# Altium schematic sheet CS4398_DAC.SchDoc: CS4398 DAC
size A4; DocumentNumber: 7; SheetNumber: 7; SheetTotal: 8
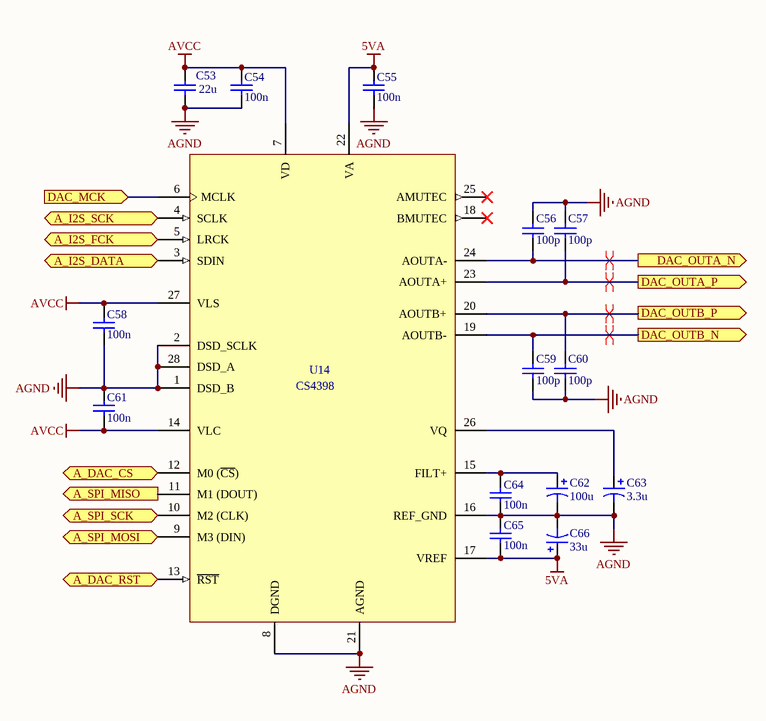
[diagram p0: CS4398_DAC.SchDoc]

## Parts
C53  22u  [PCB-rf0pzaa82dpbeu9l4sxm-1]
C54  100n  [PCB-rf0pzaa82dpbeu9l4sxm-1]
C55  100n  [PCB-rf0pzaa82dpbeu9l4sxm-1]
C56  100p  [C0402_B]
C57  100p  [C0402_B]
C58  100n  [PCB-rf0pzaa82dpbeu9l4sxm-1]
C59  100p  [C0402_B]
C60  100p  [C0402_B]
C61  100n  [PCB-rf0pzaa82dpbeu9l4sxm-1]
C62  100u  [PCB-9bfrndi9huxo1n7cihpl-1]
C63  3.3u  [PCB-3kuidc2n9u2t7zucpvy0-1]
C64  100n  [PCB-rf0pzaa82dpbeu9l4sxm-1]
C65  100n  [PCB-rf0pzaa82dpbeu9l4sxm-1]
C66  33u  [PCB-3kuidc2n9u2t7zucpvy0-1]
U14  CS4398  [PCB-b46ddvbc1rxbl1gahzd1-1]

## Ports
A_DAC_CS (in), A_DAC_RST (in), A_I2S_DATA (in), A_I2S_FCK (in), A_I2S_SCK (in), A_SPI_MISO (out), A_SPI_MOSI (in), A_SPI_SCK (in), DAC_MCK (in), DAC_OUTA_N (out), DAC_OUTA_P (out), DAC_OUTB_N (out), DAC_OUTB_P (out)

## Nets
5VA: C55.1 C65.2 C66.1 U14.17(VREF) U14.22(VA)
AGND: C53.1 C54.2 C55.2 C56.1 C57.1 C58.2 C59.2 C60.2 C61.1 C62.2 C63.2 C64.2 C65.1 C66.2 U14.1(DSD_B) U14.2(DSD_SCLK) U14.8(DGND) U14.16(REF_GND) U14.21(AGND) U14.28(DSD_A)
AVCC: C53.2 C54.1 C58.1 C61.2 U14.7(VD) U14.14(VLC) U14.27(VLS)
A_DAC_CS: U14.12(M0_(~{CS})) ; port A_DAC_CS
A_DAC_RST: U14.13(~{RST}) ; port A_DAC_RST
A_I2S_DATA: U14.3(SDIN) ; port A_I2S_DATA
A_I2S_FCK: U14.5(LRCK) ; port A_I2S_FCK
A_I2S_SCK: U14.4(SCLK) ; port A_I2S_SCK
A_SPI_MISO: U14.11(M1_(DOUT)) ; port A_SPI_MISO
A_SPI_MOSI: U14.9(M3_(DIN)) ; port A_SPI_MOSI
A_SPI_SCK: U14.10(M2_(CLK)) ; port A_SPI_SCK
DAC_MCK: U14.6(MCLK) ; port DAC_MCK
DAC_OUTA_N: C56.2 U14.24(AOUTA-) ; port DAC_OUTA_N
DAC_OUTA_P: C57.2 U14.23(AOUTA+) ; port DAC_OUTA_P
DAC_OUTB_N: C59.1 U14.19(AOUTB-) ; port DAC_OUTB_N
DAC_OUTB_P: C60.1 U14.20(AOUTB+) ; port DAC_OUTB_P
NetC62_1: C62.1 C64.1 U14.15(FILT+)
NetC63_1: C63.1 U14.26(VQ)

Not connected (* = marked no-connect by the designer): U14 18(BMUTEC)* 25(AMUTEC)*

## Layout directives
differential pair: DAC_OUTA_N, DAC_OUTA_P, DAC_OUTB_N, DAC_OUTB_P

## Notes on the sheet
- Title
- Size:
- Date:
- A4
- Number:
- Time:
- Revision:
- Sheet
- of
- File:

## Library data of the parts
C53-C55 C58 C61 C64 C65 = CMP-x8hddryxw4o380xfi98v-3: Generic Capacitor 0603; LCSC Part #: C19702
  C53: LCSC Part #: C59461; LCSC Part #: C25804; LCSC Part #: C21190; LCSC Part #: C81598
  C54 C55 C58 C61 C64 C65: CustomComponentID: x8hddryxw4o380xfi98v; LCSC Part #: C14663; LCSC Part #: C109474
C56 C57 C59 C60 = CMP-144183-3: 0402 1 uF 10 V ±10 % Tolerance X5R SMT Multilayer Ceramic Capacitor; Manufacturer Part Number: CC0402KRX5R6BB105; Lead-Free Status: Lead Free; Capacitance: 1e-06 F; Voltage Rating (DC): 10.0 V; Capacitance Tolerance: ±10%; Packaging: Cut Tape (CT); Octopart Url: http://octopart.com/cc0402krx5r6bb105-yageo-42244620; Case/Package: 0402; Mounting Style: Surface Mount; REACH SVHC Compliance: No SVHC; RoHS: Compliant; OctopartID: a1786af61e127ebf; Dielectric Characteristic: X5R; Seller Landing  Url: https://octopart-clicks.com/click/track?country=US&ak=8157f166&sig=010a0f3&sid=5489&ppid=42244620&vpid=115208218&ct=offers; Number of Pins: 2; LCSC Part #: C1546
C62 = CMP-6546a831a81eba81-4: In a Pack of 25, KEMET 100?F Electrolytic Capacitor 10V dc Through Hole - A758EK107M1AAAE016; Capacitance: 100 µF; Equivalent Series Resistance (ESR): 16.0 m?; Voltage Rating (DC): 10.0 V; Capacitance Tolerance: ±20%; Mounting Style: Through Hole; Size-Diameter: 6.30 mm; Size-Height: 8.00 mm; Operating Temperature: 105 °C (max); RoHS: Compliant; Manufacturer Part Number: A758EK107M1AAAE016; Octopart URL: https://octopart.com/a758ek107m1aaae016-kemet-75360318; OctopartID: 6546a831a81eba81
C63 C66 = CMP-e4c92dfab4043b0e-1: Cap Tant Solid 10uF 10V B CASE 10% (3.5 X 2.8 X 1.9mm) Inward L SMD 3528-21 2.5 Ohm 125C T/R; Manufacturer Part Number: TAJB106K010RNJ; Voltage Rating (DC): 10.0 V; Lead-Free Status: Lead Free; Equivalent Series Resistance (ESR): 2.50 Ω; Capacitance: 10.0 µF; Q-Factor: 6.0; Mounting Style: Surface Mount; Capacitance Tolerance: ±10%; Number of Pins: 2; RoHS: Compliant; Case/Package: 1210; Packaging: Cut Tape (CT), Tape & Reel (TR); OctopartID: e4c92dfab4043b0e; Octopart URL: http://octopart.com/tajb106k010rnj-avx-3765675; REACH SVHC Compliance: No SVHC
U14 = CMP-031cca108660dcdb-1: DAC 2-CH Delta-Sigma 24-bit 28-Pin TSSOP Rail; Manufacturer Part Number: CS4398-CZZ; Lead-Free Status: Lead Free; Number of Bits: 24; Power Dissipation: 340 mW (max); Sample Rate: 192 kHz; Supply Current: 25.0 mA; Supply Voltage (DC): 5.25 V (max), 5.00 V; Octopart URL: https://octopart.com/cs4398-czz-cirrus+logic-434202; Case/Package: TSSOP; Mounting Style: Surface Mount; Operating Temperature: 70.0 °C (max); Packaging: Tube; Number of Pins: 28; RoHS: Compliant; OctopartID: 031cca108660dcdb